# Altium project PCB0_1.PrjPcb
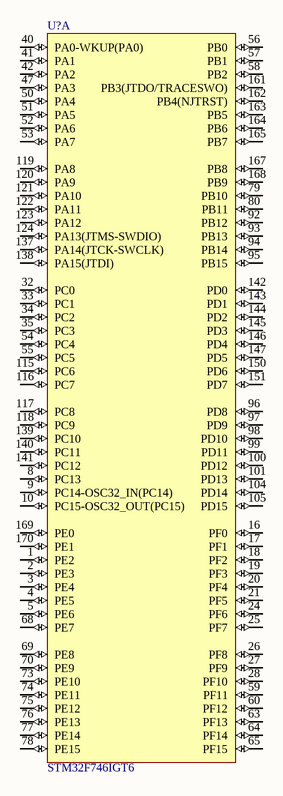
[diagram p0: WritingLearning0_1.SchDoc]
1 sheet, 1 parts. Net scope: global (net labels, ports and power ports of the same name join across sheets).

## Sheet WritingLearning0_1.SchDoc: WritingLearning
size A4; Date: 171101; SheetNumber: 1; SheetTotal: 1; Version: 0.1

### Parts
U?  STM32F746IGT6  [STM-LQFP176_N]  (part A of 3)

### Nets

Not connected (* = marked no-connect by the designer): U? 1(PE2) 2(PE3) 3(PE4) 4(PE5) 5(PE6) 8(PC13) 9(PC14-OSC32_IN(PC14)) 10(PC15-OSC32_OUT(PC15)) 16(PF0) 17(PF1) 18(PF2) 19(PF3) 20(PF4) 21(PF5) 24(PF6) 25(PF7) 26(PF8) 27(PF9) 28(PF10) 32(PC0) 33(PC1) 34(PC2) 35(PC3) 40(PA0-WKUP(PA0)) 41(PA1) 42(PA2) 47(PA3) 50(PA4) 51(PA5) 52(PA6) 53(PA7) 54(PC4) 55(PC5) 56(PB0) 57(PB1) 58(PB2) 59(PF11) 60(PF12) 63(PF13) 64(PF14) 65(PF15) 68(PE7) 69(PE8) 70(PE9) 73(PE10) 74(PE11) 75(PE12) 76(PE13) 77(PE14) 78(PE15) 79(PB10) 80(PB11) 92(PB12) 93(PB13) 94(PB14) 95(PB15) 96(PD8) 97(PD9) 98(PD10) 99(PD11) 100(PD12) 101(PD13) 104(PD14) 105(PD15) 115(PC6) 116(PC7) 117(PC8) 118(PC9) 119(PA8) 120(PA9) 121(PA10) 122(PA11) 123(PA12) 124(PA13(JTMS-SWDIO)) 137(PA14(JTCK-SWCLK)) 138(PA15(JTDI)) 139(PC10) 140(PC11) 141(PC12) 142(PD0) 143(PD1) 144(PD2) 145(PD3) 146(PD4) 147(PD5) 150(PD6) 151(PD7) 161(PB3(JTDO/TRACESWO)) 162(PB4(NJTRST)) 163(PB5) 164(PB6) 165(PB7) 167(PB8) 168(PB9) 169(PE0) 170(PE1)

### Notes on the sheet
- Title
- Date
- Version
- XB Technology

### Library data of the parts
U? = CMP-1570-00009-1: ARM-Based Cortex-M7 32 Bit MCU+FPU, 462 DMIPS, 1024 kB Flash, 320 kB RAM, 140 I/Os, -40 to 85 degC, 176-Pin LQFP, Halogen-Free, Tray; Data RAM Size: 320 KByte; Number of I/Os: 140; Clock Frequency Max: 216 MHz; Program Memory Size: 1024 KByte; Supply Voltage Max: 3.6 V; L1 Cache Instruction Memory: 4 KByte; Supply Voltage Min: 1.7 V; PartNumber: STM32F746IG; ComponentLink1Description: Manufacturer URL; Packing: Tray; ComponentLink2Description: Datasheet; DatasheetVersion: Rev. 1; ComponentLink3URL: http://www.st.com/st-web-ui/static/active/en/resource/technical/document/datasheet/DM00035129.pdf; ComponentLink1URL: http://www.st.com/web/en/home.html; ComponentLink3Description: Package Specification; Mounting Technology: Surface Mount; L1 Cache Data Memory: 4 KByte; PackageDescription: 176-Pin Low Profile Quad Flat Package, 24 x 24 mm Body, 0.5 mm Pitch; Temperature Max: 85 degC; Temperature Min: -40 degC; ComponentLink2URL: http://www.st.com/st-web-ui/static/active/en/resource/technical/document/datasheet/DM00166116.pdf